# Altium project mini-rockets.PrjPcb (part 2 of 2)

## Sheet USB_SCH.SchDoc
size A; SheetNumber: 9; SheetTotal: 9
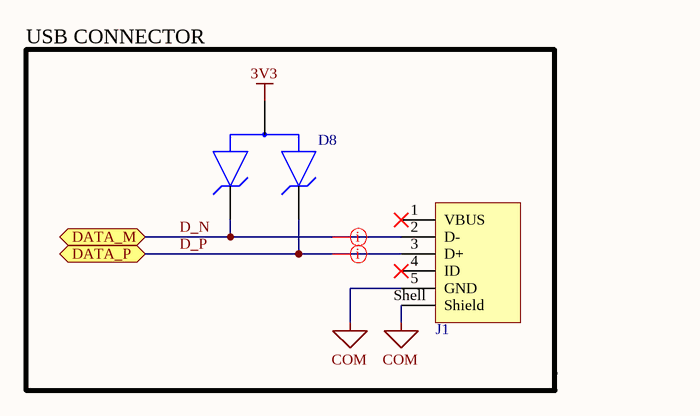
[diagram p8: USB_SCH.SchDoc]

### Parts
D8  RCLAMP0502BATCT  [FP-SC75-MFG]  (value not drawn)
J1  629105150521  [629105150521]  (value not drawn)

### Ports
DATA_M (bidir), DATA_P (bidir)

### Nets
3V3: D8.3(COMMON_ANODE)
COM: J1.5(GND) J1.Shell(Shield)
D_N: D8.2(2_CATHODE) J1.2(D-) ; port DATA_M
D_P: D8.1(1_CATHODE) J1.3(D+) ; port DATA_P

Not connected (* = marked no-connect by the designer): J1 1(VBUS)* 4(ID)*

### Layout directives
differential pair; differential pair class 90_Ohm: D_N, D_P

### Notes on the sheet
- USB CONNECTOR
- (near J1) VBUS si je veux alimenter le board par usb, mettre un circuit pour pas fry l'ordi

### Library data of the parts
D8 = CMP-56445-000003-1: TVS DIODE 5VWM 25VC SC75
J1 = 629105150521: WR-Micro USB 2.0 Type B, Receptacle, Horizontal, SMT, with Pegs; Manufacturer: Wurth Elektronik; Match Code: WR-USB; Interface Type: Type B; Number of Ports: 1; Rated Current: 3A; Working Voltage: 30VAC; ComponentLink1Description: Website Link; ComponentLink1URL: https://www.we-online.com/redexpert/article/629105150521?ad; ComponentLink2Description: Datasheet Link; ComponentLink2URL: https://www.we-online.com/redexpert/spec/629105150521?ad; Manufacturer Part Number: 629105150521; Category: Input/Output Connectors; Mount: Surface Mount; Operating Temperature Max: 85°C; Operating Temperature Min: -40°C; Packaging: Tape and Reel; Application: Micro USB 2.0; Gender: Receptacle; Number of Pins: 5; Orientation: Horizontal; Supplier 1: RSComponents; Supplier Part Number 1: 1225099

## Nets that join several sheets
3V3: Altimiter_SCH (L5.1), MCU_SCH (7 pins), Connection_SCH (J2.1), Memory_SCH (L7.1), PCU_SCH (10 pins), Ejection_SCH (R16.1 R20.1), IMU_SCH (C19.2 L6.1), USB_SCH (D8.3)
COM: Altimiter_SCH (C18.2 U5.2 U5.3), MCU_SCH (17 pins), Connection_SCH (5 pins), Memory_SCH (C22.2 U4.4), PCU_SCH (16 pins), Ejection_SCH (10 pins), IMU_SCH (7 pins), USB_SCH (J1.5 J1.Shell)
VBATT: Connection_SCH (J4.1 U7.1), PCU_SCH (D6.A)
VBATT_CONTROLLED: Connection_SCH (J3.2 J5.2 U7.2), Ejection_SCH (LS1.P)
BUZZER: MCU_SCH (U1.50), Ejection_SCH (Q5.1 R26.1)
D_N: MCU_SCH (U1.44), USB_SCH (D8.2 J1.2)
D_P: MCU_SCH (U1.45), USB_SCH (D8.1 J1.3)
EJECT_1: Connection_SCH (J3.1), Ejection_SCH (Q1.3 R17.2)
EJECT_2: Connection_SCH (J5.1), Ejection_SCH (Q3.3 R21.2)
FIRE_1: MCU_SCH (U1.54), Ejection_SCH (Q1.1 R18.2)
FIRE_2: MCU_SCH (U1.52), Ejection_SCH (Q3.1 R22.1)
HOLD: MCU_SCH (U1.34), Memory_SCH (U4.7)
INT1: MCU_SCH (U1.25), IMU_SCH (U6.4)
INT2: MCU_SCH (U1.24), IMU_SCH (U6.9)
RESET_N: MCU_SCH (R8.1 U1.7 U2.1), Connection_SCH (J2.10)
SENSE_1: MCU_SCH (U1.53), Ejection_SCH (Q2.3 R16.2)
SENSE_2: MCU_SCH (U1.51), Ejection_SCH (Q4.3 R20.2)
SPI1_CS_ALTIMITER: Altimiter_SCH (U5.4 U5.5), MCU_SCH (U1.17)
SPI1_CS_IMU: MCU_SCH (U1.20), IMU_SCH (U6.12)
SPI1_MISO: Altimiter_SCH (U5.6), MCU_SCH (U1.22), IMU_SCH (R24.2 U6.1)
SPI1_MOSI: Altimiter_SCH (U5.7), MCU_SCH (U1.23), IMU_SCH (U6.14)
SPI1_SCK: Altimiter_SCH (U5.8), MCU_SCH (U1.21), IMU_SCH (R25.2 U6.13)
SPI2_CS: MCU_SCH (U1.30), Memory_SCH (U4.1)
SPI2_MISO: MCU_SCH (U1.10), Memory_SCH (U4.2)
SPI2_MOSI: MCU_SCH (U1.11), Memory_SCH (U4.5)
SPI2_SCK: MCU_SCH (U1.29), Memory_SCH (U4.6)
SWCLK: MCU_SCH (U1.49), Connection_SCH (J2.4)
SWDIO: MCU_SCH (U1.46), Connection_SCH (J2.2)
T_TRACESWO: MCU_SCH (U1.55), Connection_SCH (J2.6)
WP: MCU_SCH (U1.35), Memory_SCH (U4.3)